# Altium schematic sheet power.SchDoc
size B; CheckedBy: João Sampaio; Author: João Sampaio; SheetNumber: 1; SheetTotal: 1; Version: V1; Link: https://github.com/sampaio00joao
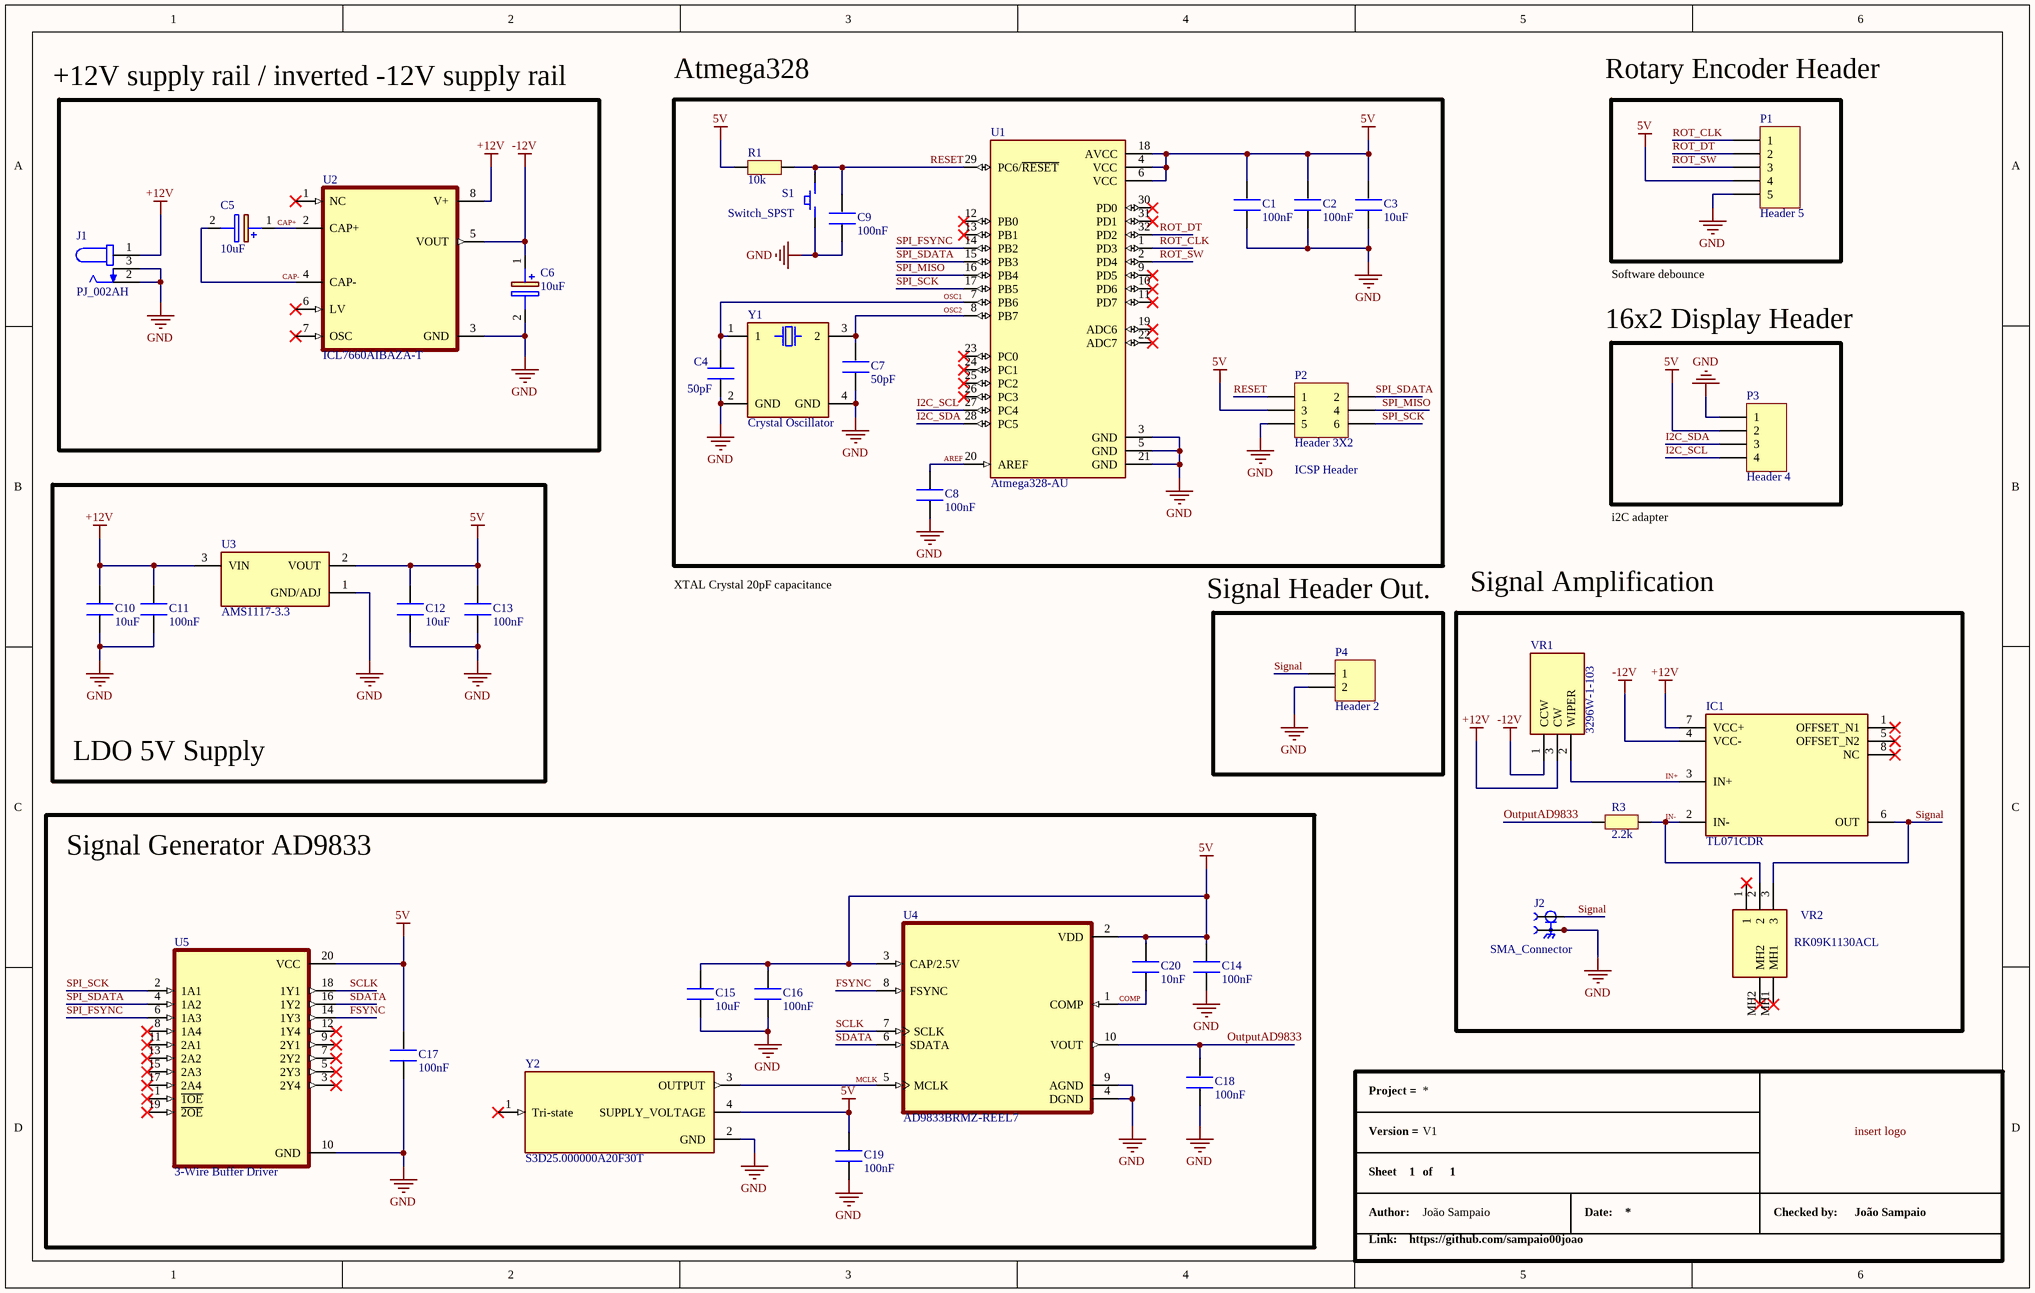
[diagram p0: power.SchDoc]

## Parts
C1  100nF  [CAP_0603]
C2  100nF  [CAP_0603]
C3  10uF  [CAP_0603]
C4  50pF  [CAP_0603]
C5  10uF  [EEE1AA220WR]
C6  10uF  [EEE1AA220WR]
C7  50pF  [CAP_0603]
C8  100nF  [CAP_0603]
C9  100nF  [CAP_0603]
C10  10uF  [CAP_0603]
C11  100nF  [CAP_0603]
C12  10uF  [CAP_0603]
C13  100nF  [CAP_0603]
C14  100nF  [CAP_0603]
C15  10uF  [CAP_0603]
C16  100nF  [CAP_0603]
C17  100nF  [CAP_0603]
C18  100nF  [CAP_0603]
C19  100nF  [CAP_0603]
C20  10nF  [CAP_0603]
IC1  TL071CDR  [SOIC127P600X175-8N]
J1  PJ_002AH  [DCJack_3pins]
J2  SMA_Connector  [SMA_Connector]
P1  Header 5  [HDR1X5]
P2  Header 3X2  [HDR2X3]
P3  Header 4  [HDR1X4]
P4  Header 2  [HDR1X2]
R1  10k  [RES_0603]
R3  2.2k  [RES_0603]
S1  Switch_SPST  [SPST-NO_Switch]
U1  Atmega328-AU  [ATMEGA328-AU]
U2  ICL7660AIBAZA-T  [ICL7660AIBAZA-T]
U3  AMS1117-3.3  [SOT229P700X180-4N]
U4  AD9833BRMZ-REEL7  [AD9833BRMZ-REEL7]
U5  3-Wire Buffer Driver  [SOP65P640X120-20N]
VR1  3296W-1-103  [3296W1103]
VR2  RK09K1130ACL  [RK09K1130ACL]
Y1  Crystal Oscillator  [4pinOscillator]
Y2  S3D25.000000A20F30T  [OSC_ECS-327TXO-30-TR]

## Blocks framed on the sheet
Atmega328: C1-C4 C7-C9 P2 R1 S1 U1 Y1
LDO 5V Supply: C10-C13 U3
Signal Amplification: IC1 J2 R3 VR1 VR2

## Nets
5V: C1.2 C2.2 C3.2 C12.2 C13.2 C14.2 C15.2 C16.2 C17.2 C19.2 C20.2 P1.4 P2.3 P3.2 R1.2 U1.4(VCC) U1.6(VCC) U1.18(AVCC) U3.2(VOUT) U4.2(VDD) U4.3(CAP/2.5V) U5.20(VCC) Y2.4(SUPPLY_VOLTAGE)
+12V: C10.2 C11.2 IC1.7(VCC+) J1.1 U2.8(V+) U3.3(VIN) VR1.3(CW)
-12V: C6.1(+) IC1.4(VCC-) U2.5(VOUT) VR1.1(CCW)
GND: C1.1 C2.1 C3.1 C4.1 C6.2(-) C7.1 C8.1 C9.1 C10.1 C11.1 C12.1 C13.1 C14.1 C15.1 C16.1 C17.1 C18.1 C19.1 J1.2 J1.3 J2.G1 J2.G2 J2.G3 J2.G4 P1.5 P2.5 P3.1 P4.2 S1.1 U1.3(GND) U1.5(GND) U1.21(GND) U2.3(GND) U3.1(GND/ADJ) U4.4(DGND) U4.9(AGND) U5.10(GND) Y1.2(GND) Y1.4(GND) Y2.2(GND)
AREF: C8.2 U1.20(AREF)
CAP+: C5.1(+) U2.2(CAP+)
CAP-: C5.2(-) U2.4(CAP-)
COMP: C20.1 U4.1(COMP)
FSYNC: U4.8(FSYNC) U5.14(1Y3)
I2C_SCL: P3.4 U1.27(PC4)
I2C_SDA: P3.3 U1.28(PC5)
IN+: IC1.3(IN+) VR1.2(WIPER)
IN-: IC1.2(IN-) R3.1 VR2.2
MCLK: U4.5(MCLK) Y2.3(OUTPUT)
OSC1: C4.2 U1.7(PB6) Y1.1
OSC2: C7.2 U1.8(PB7) Y1.3(2)
OutputAD9833: C18.2 R3.2 U4.10(VOUT)
RESET: C9.2 P2.1 R1.1 S1.2 U1.29(PC6/~{RESET})
ROT_CLK: P1.1 U1.1(PD3)
ROT_DT: P1.2 U1.32(PD2)
ROT_SW: P1.3 U1.2(PD4)
SCLK: U4.7(SCLK) U5.18(1Y1)
SDATA: U4.6(SDATA) U5.16(1Y2)
Signal: IC1.6(OUT) J2.1 P4.1 VR2.3
SPI_FSYNC: U1.14(PB2) U5.6(1A3)
SPI_MISO: P2.4 U1.16(PB4)
SPI_SCK: P2.6 U1.17(PB5) U5.2(1A1)
SPI_SDATA: P2.2 U1.15(PB3) U5.4(1A2)

Not connected (* = marked no-connect by the designer): IC1 1(OFFSET_N1)* 5(OFFSET_N2)* 8(NC)*; U1 9(PD5)* 10(PD6)* 11(PD7)* 12(PB0)* 13(PB1)* 19(ADC6)* 22(ADC7)* 23(PC0)* 24(PC1)* 25(PC2)* 26(PC3)* 30(PD0)* 31(PD1)*; U2 1(NC)* 6(LV)* 7(OSC)*; U5 1(~{1OE})* 3(2Y4)* 5(2Y3)* 7(2Y2)* 8(1A4)* 9(2Y1)* 11(2A1)* 12(1Y4)* 13(2A2)* 15(2A3)* 17(2A4)* 19(~{2OE})*; VR2 1* MH1* MH2*; Y2 1(Tri-state)*

## Notes on the sheet
- +12V supply rail / inverted -12V supply rail
- Rotary Encoder Header
- Software debounce
- 16x2 Display Header
- (near P2) ICSP Header
- i2C adapter
- XTAL Crystal 20pF capacitance
- Signal Header Out.
- Signal Generator AD9833
- Labels drawn without touching a wire or pin: insert logo
- Project =
- Version =
- Sheet
- of
- Author:
- Link:
- Date:
- Checked by:

## Library data of the parts
C1-C4 C7-C20 = Cap_0603: Capacitor SMD 0603 Generic
C5 C6 = EEE-1CA100SR: Capacitor Polarised; Manufacturer_Name: Panasonic; Datasheet Link: http://industrial.panasonic.com/cdbs/www-data/pdf/RDE0000/ABA0000C1145.pdf; Height: 5.5mm; Manufacturer_Part_Number: EEE-1CA100SR; Mouser Part Number: 667-EEE-1CA100SR; Mouser Price/Stock: https://www.mouser.co.uk/ProductDetail/Panasonic/EEE-1CA100SR?qs=ANJC8C65Mw5HUsKv8znGCA%3D%3D; Arrow Part Number: EEE-1CA100SR; Arrow Price/Stock: https://www.arrow.com/en/products/eee-1ca100sr/panasonic?region=europe
IC1 = TL071CDR: Integrated Circuit; Manufacturer_Name: Texas Instruments; Datasheet Link: http://www.ti.com/lit/gpn/tl071; Height: 1.75mm; Manufacturer_Part_Number: TL071CDR; Mouser Part Number: 595-TL071CDR; Mouser Price/Stock: https://www.mouser.co.uk/ProductDetail/Texas-Instruments/TL071CDR?qs=odmYgEirbwyeR17frtRMJg%3D%3D; Arrow Part Number: TL071CDR; Arrow Price/Stock: https://www.arrow.com/en/products/tl071cdr/texas-instruments?region=nac
J1 = DCJack_3pins
J2 = SMA_Connector: RF Coaxial Straight SMA Connector
P1 = Header 5: Header, 5-Pin; LatestRevisionDate: 17-Jul-2002; LatestRevisionNote: Re-released for DXP Platform.; Publisher: Altium Limited
P2 = Header 3X2: Header, 3-Pin, Dual row; LatestRevisionDate: 17-Jul-2002; LatestRevisionNote: Re-released for DXP Platform.; Publisher: Altium Limited
P3 = Header 4: Header, 4-Pin; LatestRevisionDate: 17-Jul-2002; LatestRevisionNote: Re-released for DXP Platform.; Publisher: Altium Limited
P4 = Header 2: Header, 2-Pin; LatestRevisionDate: 17-Jul-2002; LatestRevisionNote: Re-released for DXP Platform.; Publisher: Altium Limited
R1 R3 = Res_0603: Resistor SMD 0603 Generic
S1 = Switch_SPST: Switch_SPST 2 pins
U1 = Atmega328-AU: AVR AVR® ATmega Microcontroller IC 8-Bit 20MHz 32KB (16K x 16) FLASH 32-TQFP (7x7)
U2 = ICL7660A: Charge Pump Switching Regulator IC Positive or Negative Fixed -Vin, 2Vin 1 Output 45mA 8-SOIC (0.154", 3.90mm Width)
U3 = AMS1117-3.3: Sot223/Pkg 1-Amp 3.3-Volt Low Drop Out Voltage Regulatator
U4 = AD9833BRMZ-REEL7: Direct Digital Synthesis IC 10 b 25 MHz 28 b Tuning 10-MSOP
U5 = SN74HCT244PWR: Octal Buffers And Line Drivers With 3-State Outputs 20-TSSOP -40 to 85
VR1 = 3296W-1-103: Variable Resistor; Manufacturer_Name: Chengdu Guosheng Tech; Datasheet Link: https://datasheet.lcsc.com/szlcsc/1811271436_Chengdu-Guosheng-Tech-3296W-1-103_C330432.pdf; Height: 10.28mm; Manufacturer_Part_Number: 3296W-1-103
VR2 = RK09K1130ACL: Variable Resistor; Manufacturer_Name: ALPS Electric; Datasheet Link: https://www.alps.com/prod/info/E/HTML/Potentiometer/RotaryPotentiometers/RK09K/RK09K1130ACL.html; Height: 15mm; Manufacturer_Part_Number: RK09K1130ACL; Mouser Part Number: 688-RK09K1130ACL; Mouser Price/Stock: https://www.mouser.co.uk/ProductDetail/Alps-Alpine/RK09K1130ACL?qs=6EGMNY9ZYDQzEvxfrSIq9A%3D%3D; Arrow Part Number: RK09K1130ACL; Arrow Price/Stock: https://www.arrow.com/en/products/rk09k1130acl/alps-electric
Y1 = 4pinOscillator
Y2 = ECS-327TXO-30-TR: Oscillator TCXO 0.032768MHz Â±1.5ppm (Tol) Â±5ppm (Stability) 15pF CMOS 60% 3V 4-Pin CSMD T/R